# Altium schematic sheet MCU.SchDoc
size A
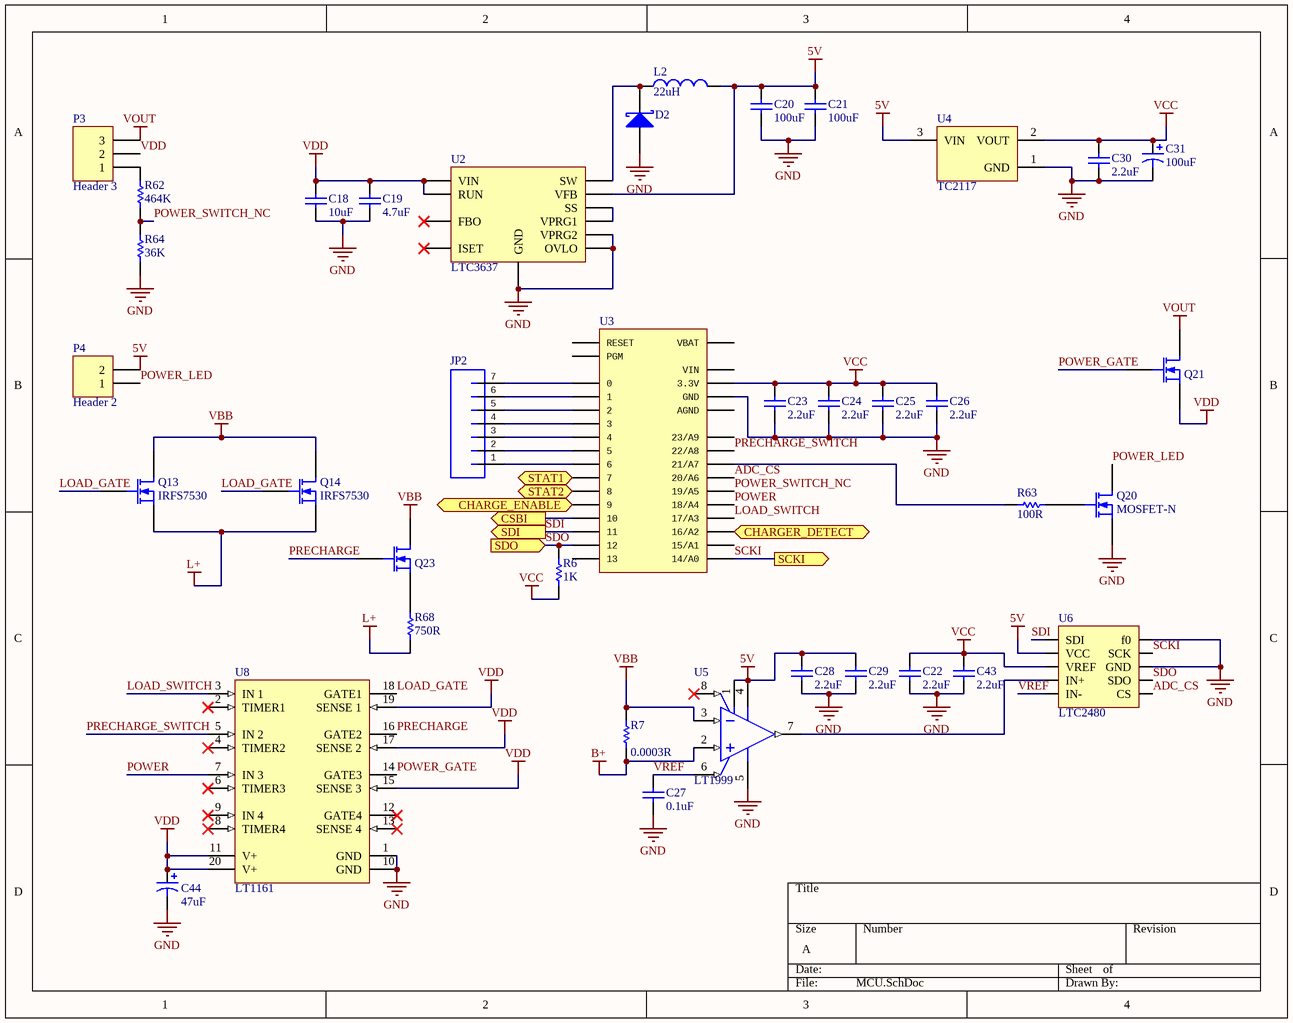
[diagram p0: MCU.SchDoc]

## Parts
C18  10uF  [CAPC1206(3216)190_M]
C19  4.7uF  [CAPC0805(2012)145_N]
C20  100uF  [CAPC1210(3225)280_N]
C21  100uF  [CAPC1210(3225)280_N]
C22  2.2uF  [CAPC0603(1608)55_N]
C23  2.2uF  [CAPC0603(1608)55_N]
C24  2.2uF  [CAPC0603(1608)55_N]
C25  2.2uF  [CAPC0603(1608)55_N]
C26  2.2uF  [CAPC0603(1608)55_N]
C27  0.1uF  [CAPC0603(1608)55_N]
C28  2.2uF  [CAPC0603(1608)100_N]
C29  2.2uF  [CAPC0603(1608)100_N]
C30  2.2uF  [CAPC0603(1608)55_N]
C31  100uF  [AVX-CAPC7343_V]
C43  2.2uF  [CAPC0603(1608)55_N]
C44  value 47uF  [CAP 300uF 6.3V]
D2  (no value)  [SMB]
JP2  (no value)  [JST-7-PTH]
L2  value 22uH  [SDR0805-180ML]  (hidden comment: SDR0805-180ML)
P3  Header 3  [HDR1X3]
P4  Header 2  [HDR1X2]
Q13  IRFS7530  [DPAK127P1525X483-7N]
Q14  IRFS7530  [DPAK127P1525X483-7N]
Q20  MOSFET-N  [SOT23-3]
Q21  MOSFET-N  [SOIC127P600X175-8N]  (value not drawn)
Q23  MOSFET-N  [SOT23-3]  (value not drawn)
R6  1K  [RESC0603(1608)_L]
R7  value 0.0003R  [WSLP5931]
R62  464K  [RESC0603(1608)_M]
R63  100R  [RESC0603(1608)_L]
R64  36K  [RESC0603(1608)_M]
R68  750R  [RESC2512(6432)_N]
U2  LTC3637  [SON50P300X85_HS-17N]
U3  (no value)  [TEENSY_3.0_BASIC]
U4  TC2117  [SOT-223-DB3_M]
U5  LT1999  [LT-MS8-8_N]
U6  LTC2480  [MSOP10]
U8  LT1161  [LT-SW-20_M]

## Ports
CHARGE_ENABLE (out), CHARGER_DETECT (in), CSBI (out), SCKI (out), SDI (out), SDO (in), STAT1 (in), STAT2 (in)

## Nets
5V: C20.2 C21.2 C28.2 C29.2 L2.2 P4.2 U2.9(VFB) U4.3(VIN) U5.1(V+) U5.4(V+) U6.1(VCC)
B+: R7.2 U5.2(+IN)
GND: C18.1 C19.2 C20.1 C21.1 C22.1 C23.1 C24.1 C25.1 C26.1 C27.1 C28.1 C29.1 C30.2 C31.2 C43.1 C44.2 D2.1(A) Q20.3(S) R64.1 U2.6(VPRG2) U2.12(OVLO) U2.17(GND) U3.GND_GND1(GND) U4.1(GND) U5.5(GND) U6.5(f0) U6.7(GND) U8.1(GND) U8.10(GND)
L+: Q13.3(S) Q14.3(S) R68.1
VBB: Q13.1(D) Q14.1(D) Q23.2(D) R7.1 U5.3(-IN)
VCC: C22.2 C23.2 C24.2 C25.2 C26.2 C30.1 C31.1 C43.2 R6.1 U3.3.3V_3.3V1(3.3V) U4.2(VOUT) U6.2(VREF)
VDD: C18.2 C19.1 C44.1 P3.2 Q21.3(S) U2.3(VIN) U2.14(RUN) U8.11(V+) U8.15(SENSE_3) U8.17(SENSE_2) U8.19(SENSE_1) U8.20(V+)
VOUT: P3.3 Q21.2(D)
ADC_CS: U3.20/A6 U6.9(CS)
CHARGE_ENABLE: U3.9 ; port CHARGE_ENABLE
CHARGER_DETECT: U3.16/A2 ; port CHARGER_DETECT
CSBI: U3.10 ; port CSBI
LOAD_GATE: Q13.2(G) Q14.2(G) U8.18(GATE1)
LOAD_SWITCH: U3.17/A3 U8.3(IN_1)
POWER: U3.18/A4 U8.7(IN_3)
POWER_GATE: Q21.1(G) U8.14(GATE3)
POWER_LED: P4.1 Q20.2(D)
POWER_SWITCH_NC: R62.1 R64.2 U3.19/A5
PRECHARGE: Q23.1(G) U8.16(GATE2)
PRECHARGE_SWITCH: U3.22/A8 U8.5(IN_2)
SCKI: U3.14/A0 U6.6(SCK) ; port SCKI
SDI: U3.11 U6.0(SDI) ; port SDI
SDO: R6.2 U3.12 U6.8(SDO) ; port SDO
STAT1: U3.7 ; port STAT1
STAT2: U3.8 ; port STAT2
VREF: C27.2 U5.6(REF) U6.4(IN-)
NetD2_2: D2.2(K) L2.1 U2.1(SW)
NetJP2_1: JP2.1 U3.6
NetJP2_2: JP2.2 U3.5
NetJP2_3: JP2.3 U3.4
NetJP2_4: JP2.4 U3.3
NetJP2_5: JP2.5 U3.2
NetJP2_6: JP2.6 U3.1
NetJP2_7: JP2.7 U3.0
NetP3_1: P3.1 R62.2
NetQ20_1: Q20.1(G) R63.2
NetQ23_3: Q23.3(S) R68.2
NetR63_1: R63.1 U3.21/A7
NetU2_7: U2.7(VPRG1) U2.10(SS)
NetU5_7: U5.7(OUT) U6.3(IN+)

Not connected (* = marked no-connect by the designer): U2 5(FBO)* 11(ISET)*; U3 13 15/A1 23/A9 AGND PGM RESET VBAT VIN; U5 8(~{SHDN})*; U8 2(TIMER1)* 4(TIMER2)* 6(TIMER3)* 8(TIMER4)* 9(IN_4)* 12(GATE4)* 13(SENSE_4)*

## Library data of the parts
C18 = CMP-1037-04982-1: CAP 10uF 50V Â±10% 1206 (3216 Metric) Thickness 1.9mm SMD; Case-EIA: 1206; Case-Metric: 3216; Technology: SMT; Tolerance: Â±10%; Max Thickness: 1.9 mm; Value: 10uF; Rated Voltage: 50 V
C19 = CMP-1036-04900-1: CAP 4.7uF 50V Â±10% 0805 (2012 Metric) Thickness 1.45mm SMD; Case-Metric: 2012; Case-EIA: 0805; Value: 4.7uF; Tolerance: Â±10%; Technology: SMT; Max Thickness: 1.45 mm; Rated Voltage: 50 V
C20 C21 = CMP-1038-02301-1: CAP 100uF 10V Â±10% 1210 (3225 Metric) Thickness 2.8mm SMD; Case-EIA: 1210; Case-Metric: 3225; Rated Voltage: 6.3 V; Value: 100uF; Tolerance: Â±10%; Technology: SMT; Max Thickness: 2.8 mm
C22 C43 = CMP-1035-02751-1: CAP 2.2uF 4V Â±10% 0603 (1608 Metric) Thickness 0.55mm SMD; Case-EIA: 0603; Case-Metric: 1608; Tolerance: Â±10%; Rated Voltage: 4 V; Technology: SMT; Max Thickness: 0.55 mm; Value: 2.2uF
C23-C27 C30 = CMP-1035-02762-1: CAP 2.2uF 16V Â±10% 0603 (1608 Metric) Thickness 0.55mm SMD; Case-EIA: 0603; Case-Metric: 1608; Max Thickness: 0.55 mm; Technology: SMT; Value: 2.2uF; Rated Voltage: 16 V; Tolerance: Â±10%
C28 = CMP-1035-02575-1: CAP 100nF 6.3V Â±5% 0603 (1608 Metric) Thickness 1mm SMD; Case-Metric: 1608; Case-EIA: 0603; Tolerance: Â±5%; Technology: SMT; Rated Voltage: 6.3 V; Max Thickness: 1 mm; Value: 100nF
C29 = CMP-1035-02730-1: CAP 1uF 6.3V Â±10% 0603 (1608 Metric) Thickness 1mm SMD; Case-EIA: 0603; Case-Metric: 1608; Rated Voltage: 6.3 V; Max Thickness: 1 mm; Technology: SMT; Tolerance: Â±10%; Value: 1uF
C31 = AVX-CAP-P-2
C44 = CAP 47uF 50V: Polarized Capacitor (Axial); Published: 8-Jun-2000; LatestRevisionDate: 17-Jul-2002; LatestRevisionNote: Re-released for DXP Platform.; PackageReference: POLAR0.8; Publisher: Altium Limited; PackageDescription: Polarized Capacitor; 2 Leads
D2 = D Schottky: Schottky Diode; Published: 8-Jun-2000; LatestRevisionDate: 17-Jul-2002; LatestRevisionNote: Re-released for DXP Platform.; PackageReference: SMB; Publisher: Altium Limited; PackageDescription: DO-214-AA/SMB; 2 C-Bend Leads; Body 5.3 x 3.6 mm, inc. leads (LxW); Code_JEDEC: DO-214-AA
JP2 = JST_7_RIGHT
L2 = SDR0805-180ML: Inductor; Code_IEC: 1005; Published: 8-Jun-2000; LatestRevisionDate: 29-May-2009; LatestRevisionNote: IPC-7351 Footprint Added.; PackageReference: 0402-A; Publisher: Altium Limited; PackageDescription: Chip Inductor; Code_JEITA: 0402
P3 = Header 3: Header, 3-Pin; LatestRevisionDate: 17-Jul-2002; LatestRevisionNote: Re-released for DXP Platform.; Publisher: Altium Limited
P4 = Header 2: Header, 2-Pin; LatestRevisionDate: 17-Jul-2002; LatestRevisionNote: Re-released for DXP Platform.; Publisher: Altium Limited
Q13 Q14 = IRFS7530: N-Channel MOSFET; pin to pad: 1>8 2>1 3>2+3+5+6+7; Published: 8-Jun-2000; LatestRevisionDate: 17-Jul-2002; LatestRevisionNote: Re-released for DXP Platform.; PackageVersion: 1995/1996; PackageReference: E3; Publisher: Altium Limited; PackageDescription: TO, Flat Index; 3 In-Line, Axial Leads; Body Dia. 4.6mm; Lead Dia. 0.5 mm (max)
Q20 Q23 = MOSFET-N: N-Channel MOSFET; Published: 8-Jun-2000; LatestRevisionDate: 17-Jul-2002; LatestRevisionNote: Re-released for DXP Platform.; PackageVersion: 1995/1996; PackageReference: E3; Publisher: Altium Limited; PackageDescription: TO, Flat Index; 3 In-Line, Axial Leads; Body Dia. 4.6mm; Lead Dia. 0.5 mm (max)
Q21 = MOSFET-N: N-Channel MOSFET; pin to pad: 1>2 2>3 3>1; Published: 8-Jun-2000; LatestRevisionDate: 17-Jul-2002; LatestRevisionNote: Re-released for DXP Platform.; PackageVersion: 1995/1996; PackageReference: E3; Publisher: Altium Limited; PackageDescription: TO, Flat Index; 3 In-Line, Axial Leads; Body Dia. 4.6mm; Lead Dia. 0.5 mm (max)
R6 = CMP-1012-00074-1: 1K 0.1W 5% 0603 (1608 Metric)  SMD; Case-EIA: 0603; Case-Metric: 1608; Value: 1000.00 Ohm; Technology: SMT; Tolerance: 5 %; Power: 0.1 W
R7 = SHUNT: Resistor; Published: 8-Jun-2000; LatestRevisionDate: 17-Jul-2002; LatestRevisionNote: Re-released for DXP Platform.; PackageReference: AXIAL-0.3; Publisher: Altium Limited; PackageDescription: Axial Device, Thru-Hole; 2 Leads; 0.3 in Pin Spacing
R62 = CMP-1012-00811-1: 464K 0.1W 1% 0603 (1608 Metric)  SMD; Value: 464000.00 Ohm; Case-Metric: 1608; Case-EIA: 0603; Tolerance: 1 %; Power: 0.1 W; Technology: SMT
R63 = CMP-1012-00050-1: 100R 0.1W 5% 0603 (1608 Metric)  SMD; Case-EIA: 0603; Value: 100.00 Ohm; Case-Metric: 1608; Tolerance: 5 %; Technology: SMT; Power: 0.1 W
R64 = CMP-1012-00685-1: 36K 0.1W 1% 0603 (1608 Metric)  SMD; Case-Metric: 1608; Value: 36000.00 Ohm; Case-EIA: 0603; Technology: SMT; Power: 0.1 W; Tolerance: 1 %
R68 = CMP-1018-00496-1: 750R 1W 1% 2512 (6432 Metric)  SMD; Value: 750.00 Ohm; Case-EIA: 2512; Case-Metric: 6432; Tolerance: 1 %; Technology: SMT; Power: 1 W
U2 = LTC3637: pin to pad: 17>8+16+17
U3 = TEENSY_3.0_BASIC: pin to pad: 3.3V 3.3V1>3.3V+3.3V1 GND GND1>GND+GND1
U4 = PM-LINEREG-TC2117-IL4: pin to pad: 2>2+4
U5 = CMP-0359-00619-2: Single Channel, High Voltage, Bidirectional Current Sense Amplifier, 2 MHz Typical GBW, 3 V/us Typical SR, 4.5 to 5.5 V, 8-Pin SOP (MS8-8), High Temperature / Automotive, Pb-Free, Reel; Manufacturer: Linear Technology; PartNumber: LT1999HMS8-20#TRPBF; Linear Technology Part Number: LT1999-20; Is (mA) Typical: 1.55; SR (V/us) Typical: 3; Channels (#): 1; Vs Max (V): 5.5; GBW (MHz) Typical: 2; Vs Min (V): 4.5; Vos (mV) Typical: 0.5; ComponentLink2Description: Datasheet; DatasheetVersion: Rev. B; PackageVersion: Rev G; ComponentLink3Description: Package Specification; ComponentLink2URL: http://cds.linear.com/docs/en/datasheet/1999fb.pdf; PackageReference: LT-MS8-8; PackageDescription: 8-Lead Plastic Small Outline, Body 3.9 x 4.9 mm, Pitch 1.27 mm; RevisionNote: URLs updated; Type: CSA; RoHS: Pb-Free; ComponentLink1URL: http://www.linear.com/; Packing: Reel; ComponentLink3URL: http://cds.linear.com/docs/en/packaging/05081610_G_SO8.pdf; ComponentLink1Description: Manufacturer URL; Mounting Technology: Surface Mount
U8 = CMP-0479-00631-1: Quad Protected High-Side MOSFET Driver, 8 to 48 V Vin, 20-pin SOIC (SW-20), -40 to 85 degC, Pb-Free; Manufacturer: Linear Technology; PartNumber: LT1161ISW#PBF; ComponentLink3URL: http://cds.linear.com/docs/en/packaging/SO_20_05-08-1620.pdf; RoHS: TRUE; ComponentLink1URL: http://www.linear.com/; PackageDescription: 20-Pin Plastic Small Outline, Body 12.80 x 7.49 mm, Pitch 1.27 mm; DatasheetVersion: Rev. A; ComponentLink1Description: Manufacturer URL; ComponentLink3Description: Package Specification; ComponentLink2URL: http://cds.linear.com/docs/en/datasheet/1161fa.pdf; PackageReference: SW-20; PackageVersion: Jun-10; ComponentLink2Description: Datasheet; Mounting Technology: Surface Mount